# Altium schematic sheet Connector - JST.SchDoc
size A3; SheetNumber: 18; SheetTotal: 41
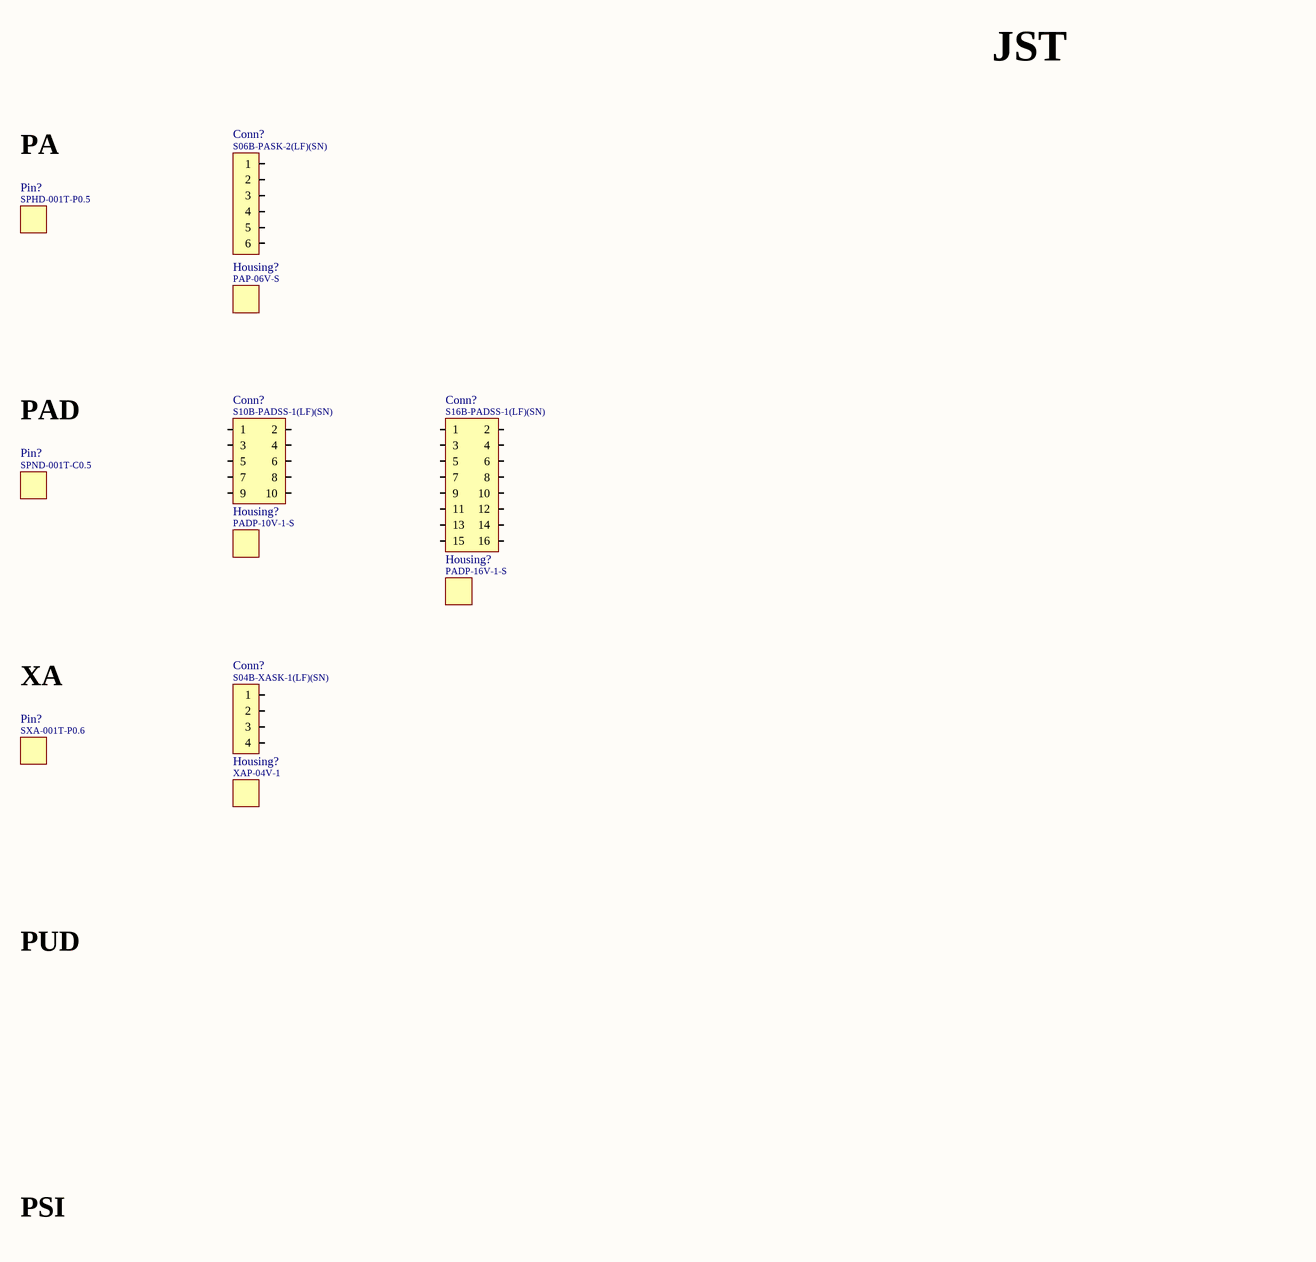
[diagram p0: Connector - JST.SchDoc]

## Parts
(Parts that share a designator on the sheet are numbered #1, #2 ... from top to bottom, then left to right.)
Conn?#1  Manufacturer Part Number: S06B-PASK-2(LF)(SN)  [Connector, S06B-PASK-2]  (hidden comment: Connector - 6P)
Conn?#2  Manufacturer Part Number: S10B-PADSS-1(LF)(SN)  [Connector, S10B-PADSS-1]  (hidden comment: Connector - 10P)
Conn?#3  Manufacturer Part Number: S16B-PADSS-1(LF)(SN)  [Connector, S16B-PADSS-1]  (hidden comment: Connector - 16P)
Conn?#4  Manufacturer Part Number: S04B-XASK-1(LF)(SN)  [Connector, S04B-XASK-1]  (hidden comment: Connector - 4P)
Housing?#1  Manufacturer Part Number: PAP-06V-S  [Housing, PAP-06V-S]  (hidden comment: Housing)
Housing?#2  Manufacturer Part Number: PADP-10V-1-S  [Housing, PADP-10V-1-S]  (hidden comment: Housing)
Housing?#3  Manufacturer Part Number: PADP-16V-1-S  [Housing, PADP-16V-1-S]  (hidden comment: Housing)
Housing?#4  Manufacturer Part Number: XAP-04V-1  [Housing, PAP-06V-S]  (hidden comment: Housing)
Pin?#1  Manufacturer Part Number: SPHD-001T-P0.5  [Pin, SPHD-001T-P0.5]  (hidden comment: Pin)
Pin?#2  Manufacturer Part Number: SPND-001T-C0.5  [Pin, SPND-001T-C0.5]  (hidden comment: Pin)
Pin?#3  Manufacturer Part Number: SXA-001T-P0.6  [Pin, SPHD-001T-P0.5]  (hidden comment: Pin)

## Nets

Not connected (* = marked no-connect by the designer): Conn?#1 1 2 3 4 5 6; Conn?#2 1 2 3 4 5 6 7 8 9 10; Conn?#3 1 2 3 4 5 6 7 8 9 10 11 12 13 14 15 16; Conn?#4 1 2 3 4

## Notes on the sheet
- JST
- (near Pin?#1) PA
- (near Pin?#2) PAD
- (near Pin?#3) XA
- PUD
- PSI

## Library data of the parts
Conn?#1 = Connector - 6P: Conn, JST, 6P, TH, PA, Side Entry; ComponentLink1Description: Datasheet; ComponentLink1URL: E:\Altium\Datasheets\Connector - JST\PA Family.pdf; ComponentLink2Description: Supplier Link; ComponentLink2URL: https://www.digikey.com/en/products/detail/jst-sales-america-inc/S06B-PASK-2-LF-SN/926757; Supplier: Digikey; Supplier Part Number: 455-1851-ND; Manufacturer: JST; Operating Temperature, Min: -25℃; Operating Temperature, Max: +85℃; Quantity, Min: 1; Quantity, Max: 10000; Price, Min: 0.51; Supplier Currency: $; Price, Max: 0.21423; Supplier Link: https://www.digikey.com/en/products/detail/jst-sales-america-inc/S06B-PASK-2-LF-SN/926757; Component Type: PCB; Component Category: Connector; Package: TH, Side
Conn?#2 = Connector - 10P: Conn, JST, 10P, TH, PAD, Side Entry; ComponentLink1Description: Datasheet; ComponentLink1URL: E:\Altium\Datasheets\Connector - JST\PAD Family.pdf; ComponentLink2Description: Supplier Link; ComponentLink2URL: https://www.digikey.com/en/products/detail/jst-sales-america-inc/S10B-PADSS-1-LF-SN/1634773; Supplier: Digikey; Supplier Part Number: 455-2032-ND; Manufacturer: JST; Operating Temperature, Min: -25℃; Operating Temperature, Max: +85℃; Quantity, Min: 1; Quantity, Max: 10080; Price, Min: 0.65; Supplier Currency: $; Price, Max: 0.27565; Supplier Link: https://www.digikey.com/en/products/detail/jst-sales-america-inc/S10B-PADSS-1-LF-SN/1634773; Component Type: PCB; Component Category: Connector; Package: TH, 2 Rows, RA, Side Entry
Conn?#3 = Connector - 16P: Conn, JST, 16P, TH, PAD, Side Entry; ComponentLink1Description: Datasheet; ComponentLink1URL: E:\Altium\Datasheets\Connector - JST\PAD Family.pdf; ComponentLink2Description: Supplier Link; ComponentLink2URL: https://www.digikey.com/en/products/detail/jst-sales-america-inc/S16B-PADSS-1-LF-SN/1634778; Supplier: Digikey; Supplier Part Number: 455-2037-ND; Manufacturer: JST; Operating Temperature, Min: -25℃; Operating Temperature, Max: +85℃; Quantity, Min: 1; Quantity, Max: 10080; Price, Min: 0.77; Supplier Currency: $; Price, Max: 0.35386; Supplier Link: https://www.digikey.com/en/products/detail/jst-sales-america-inc/S16B-PADSS-1-LF-SN/1634778; Component Type: PCB; Component Category: Connector; Package: TH, 2 Rows, RA, Side Entry
Conn?#4 = Connector - 4P: Conn, JST, 4P, TH, XA, Side Entry; ComponentLink1Description: Datasheet; ComponentLink1URL: E:\Altium\Datasheets\Connector - JST\XA Family.pdf; ComponentLink2Description: Supplier Link; ComponentLink2URL: https://www.digikey.com/en/products/detail/jst-sales-america-inc/S04B-XASK-1-LF-SN/7230506; Supplier: Digikey; Supplier Part Number: 455-4090-ND; Manufacturer: JST; Operating Temperature, Min: -25℃; Operating Temperature, Max: +85℃; Quantity, Min: 1; Quantity, Max: 10000; Price, Min: 0.53; Supplier Currency: $; Price, Max: 0.22547; Supplier Link: https://www.digikey.com/en/products/detail/jst-sales-america-inc/S04B-XASK-1-LF-SN/7230506; Component Type: PCB; Component Category: Connector; Package: SMD, TH, Side Entry
Housing?#1 = Housing: Housing, JST, PAP-06V-S; Component Category: Connector; ComponentLink1Description: Datasheet; ComponentLink1URL: E:\Altium\Datasheets\Connector - JST\PA Family.pdf; ComponentLink2Description: Supplier Link; ComponentLink2URL: https://www.digikey.com/en/products/detail/jst-sales-america-inc/PAP-06V-S/759978; Supplier: Digikey; Supplier Part Number: 455-1490-ND; Manufacturer: JST; Operating Temperature, Min: -25℃; Operating Temperature, Max: +85℃; Quantity, Min: 1; Quantity, Max: 2500; Price, Min: 0.19; Supplier Currency: $; Price, Max: 0.07808; Supplier Link: https://www.digikey.com/en/products/detail/jst-sales-america-inc/PAP-06V-S/759978; Component Type: PCB; Package: Housing
Housing?#2 = Housing: Housing, JST, 10P, PAD; Component Category: Connector; ComponentLink1Description: Datasheet; ComponentLink1URL: E:\Altium\Datasheets\Connector - JST\PAD Family.pdf; ComponentLink2Description: Supplier Link; ComponentLink2URL: https://www.digikey.com/en/products/detail/jst-sales-america-inc/PADP-10V-1-S/1300221; Supplier: Digikey; Supplier Part Number: 455-2140-ND; Manufacturer: JST; Operating Temperature, Min: -25℃; Operating Temperature, Max: +85℃; Quantity, Min: 1; Quantity, Max: 2500; Price, Min: 0.33; Supplier Currency: $; Price, Max: 0.14264; Supplier Link: https://www.digikey.com/en/products/detail/jst-sales-america-inc/PADP-10V-1-S/1300221; Component Type: PCB; Package: Housing
Housing?#3 = Housing: Housing, JST, 16P, PAD; Component Category: Connector; ComponentLink1Description: Datasheet; ComponentLink1URL: E:\Altium\Datasheets\Connector - JST\PAD Family.pdf; ComponentLink2Description: Supplier Link; ComponentLink2URL: https://www.digikey.com/en/products/detail/jst-sales-america-inc/PADP-16V-1-S/1300224; Supplier: Digikey; Supplier Part Number: 455-2143-ND; Manufacturer: JST; Operating Temperature, Min: -25℃; Operating Temperature, Max: +85℃; Quantity, Min: 1; Quantity, Max: 2500; Price, Min: 0.35; Supplier Currency: $; Price, Max: 0.152; Supplier Link: https://www.digikey.com/en/products/detail/jst-sales-america-inc/PADP-16V-1-S/1300224?s=N4IgTCBcDaIAoEEAicC0BGAbANQyAugL5A; Component Type: PCB; Package: Housing
Housing?#4 = Housing: Housing, JST, 4P, XA; Component Category: Connector; ComponentLink1Description: Datasheet; ComponentLink1URL: E:\Altium\Datasheets\Connector - JST\XA Family.pdf; ComponentLink2Description: Supplier Link; ComponentLink2URL: https://www.digikey.com/en/products/detail/jst-sales-america-inc/XAP-04V-1/959010; Supplier: Digikey; Supplier Part Number: 455-2150-ND; Manufacturer: JST; Operating Temperature, Min: -25℃; Operating Temperature, Max: +85℃; Quantity, Min: 1; Quantity, Max: 2500; Price, Min: 0.16; Supplier Currency: $; Price, Max: 0.05958; Supplier Link: https://www.digikey.com/en/products/detail/jst-sales-america-inc/XAP-04V-1/959010; Component Type: Housing; Package: Housing
Pin?#1 = Pin: Pin, JST, SPHD-001T-P0.5; Component Category: Connector; ComponentLink1Description: Datasheet; ComponentLink1URL: E:\Altium\Datasheets\Connector - JST\PA Family.pdf; ComponentLink2Description: Supplier Link; ComponentLink2URL: https://www.digikey.com/en/products/detail/jst-sales-america-inc/SPHD-001T-P0-5/608766; Supplier: Digikey; Supplier Part Number: 455-1325-1-ND; Manufacturer: JST; Operating Temperature, Min: *℃; Operating Temperature, Max: *℃; Quantity, Min: 1; Quantity, Max: 2500; Price, Min: 0.1; Supplier Currency: $; Price, Max: 0.01478; Supplier Link: https://www.digikey.com/en/products/detail/jst-sales-america-inc/SPHD-001T-P0-5/608766; Component Type: PCB; Package: Housing
Pin?#2 = Pin: Pin, JST, SPND-001T-C0.5; Component Category: Connector; ComponentLink1Description: Datasheet; ComponentLink1URL: E:\Altium\Datasheets\Connector - JST\PAD Family.pdf; ComponentLink2Description: Supplier Link; ComponentLink2URL: https://www.digikey.com/en/products/detail/jst-sales-america-inc/SPND-001T-C0-5/1788519; Supplier: Digikey; Supplier Part Number: 455-2303-1-ND; Manufacturer: JST; Operating Temperature, Min: ---℃; Operating Temperature, Max: ---℃; Quantity, Min: 1; Quantity, Max: 56000; Price, Min: 0.1; Supplier Currency: $; Price, Max: 0.01409; Supplier Link: https://www.digikey.com/en/products/detail/jst-sales-america-inc/SPND-001T-C0-5/1788519; Component Type: PCB; Package: Housing
Pin?#3 = Pin: Pin, JST, SXA-001T-P0.6; Component Category: Connector; ComponentLink1Description: Datasheet; ComponentLink1URL: E:\Altium\Datasheets\Connector - JST\XA Family.pdf; ComponentLink2Description: Supplier Link; ComponentLink2URL: https://www.digikey.com/en/products/detail/jst-sales-america-inc/SXA-001T-P0-6/923775; Supplier: Digikey; Supplier Part Number: 455-1904-1-ND; Manufacturer: JST; Operating Temperature, Min: ---℃; Operating Temperature, Max: ---℃; Quantity, Min: 1; Quantity, Max: 56000; Price, Min: 0.1; Supplier Currency: $; Price, Max: 0.01303; Supplier Link: https://www.digikey.com/en/products/detail/jst-sales-america-inc/SXA-001T-P0-6/923775; Component Type: Pin; Package: Housing